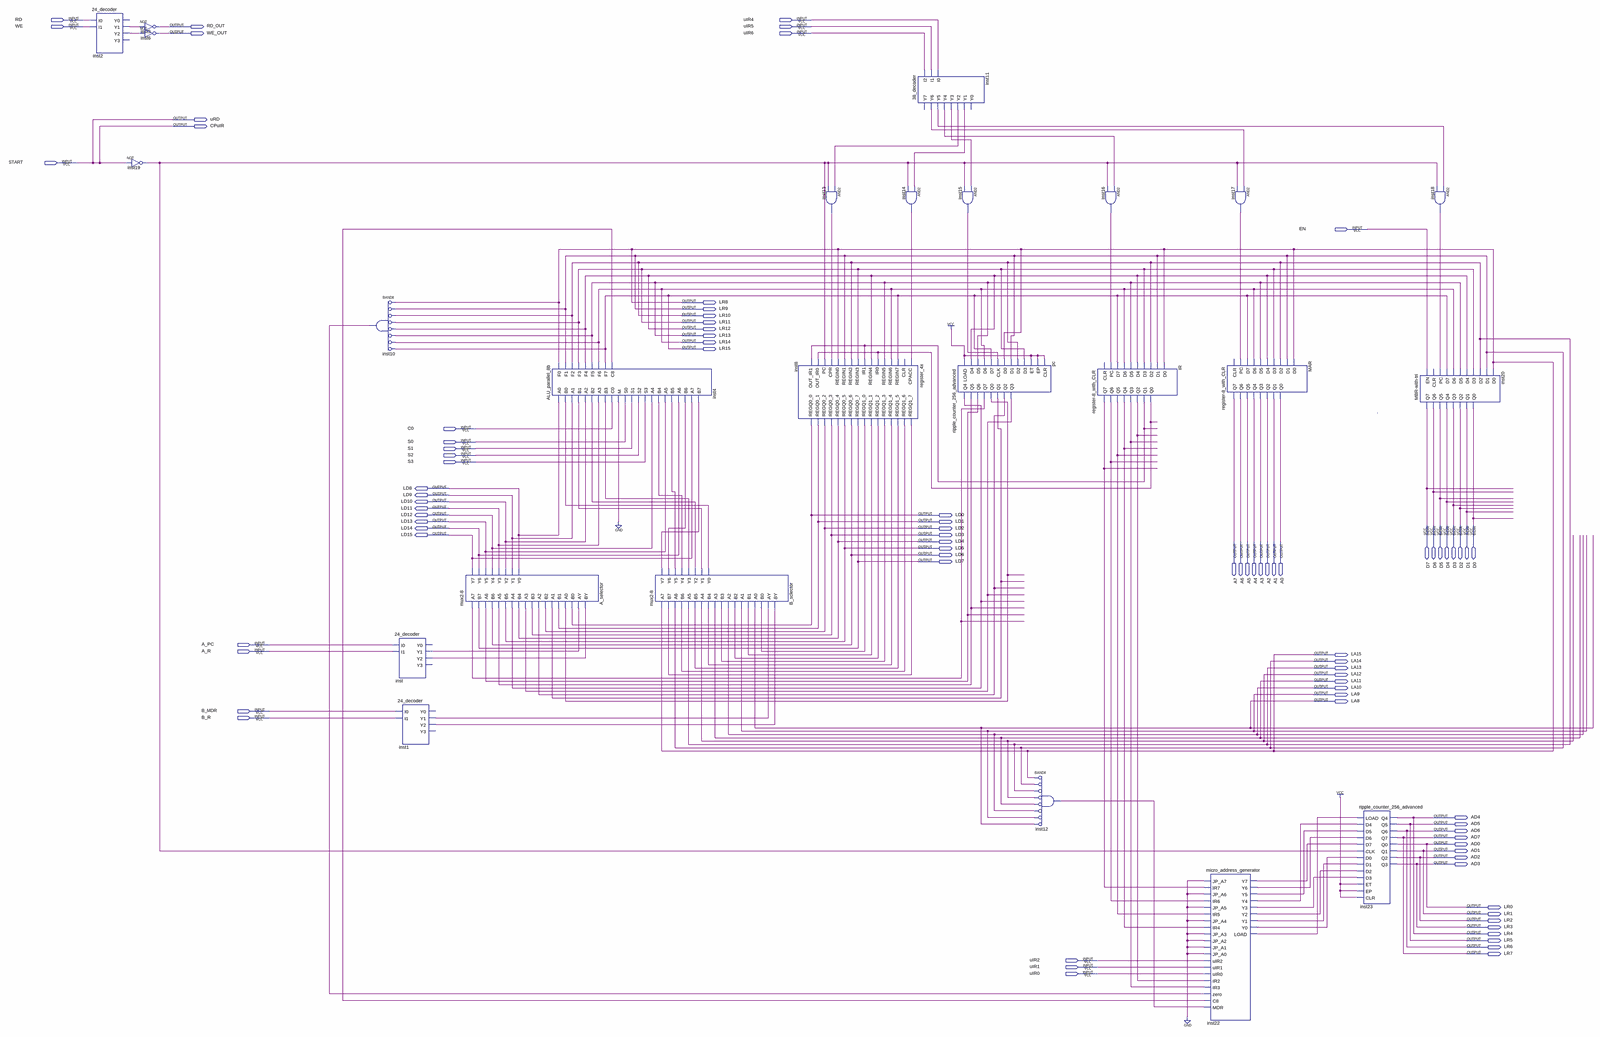
[diagram p0: schematic sheet, whole]
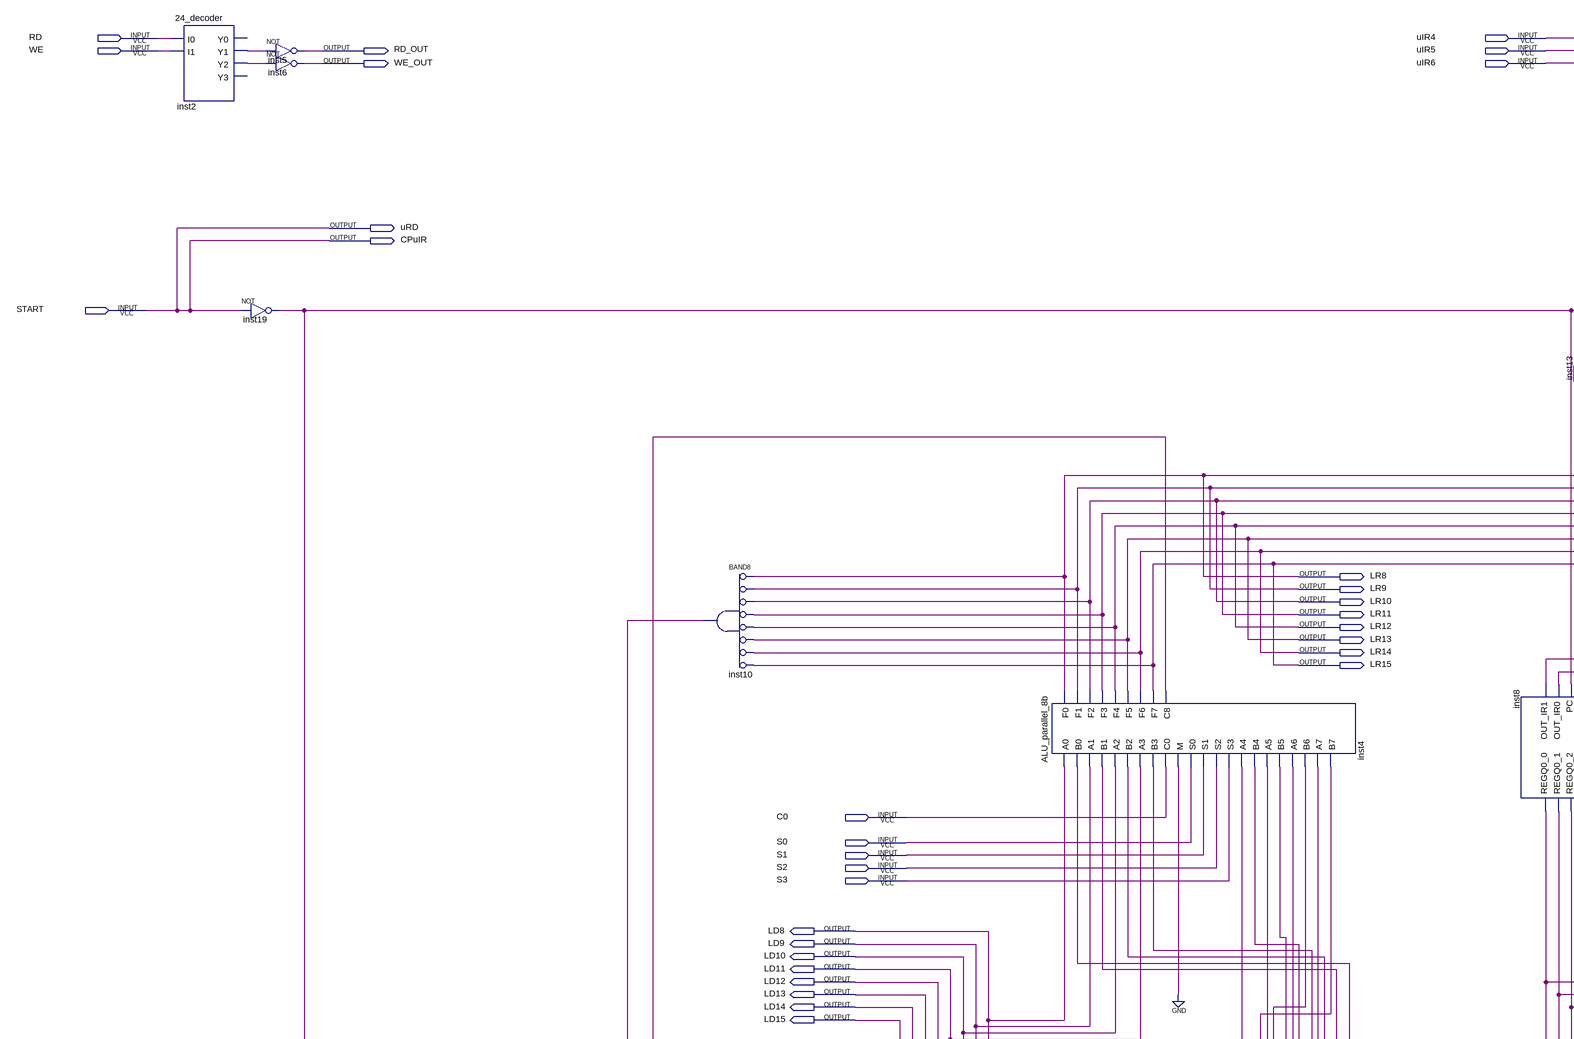
[diagram p1: schematic sheet, upper left part]
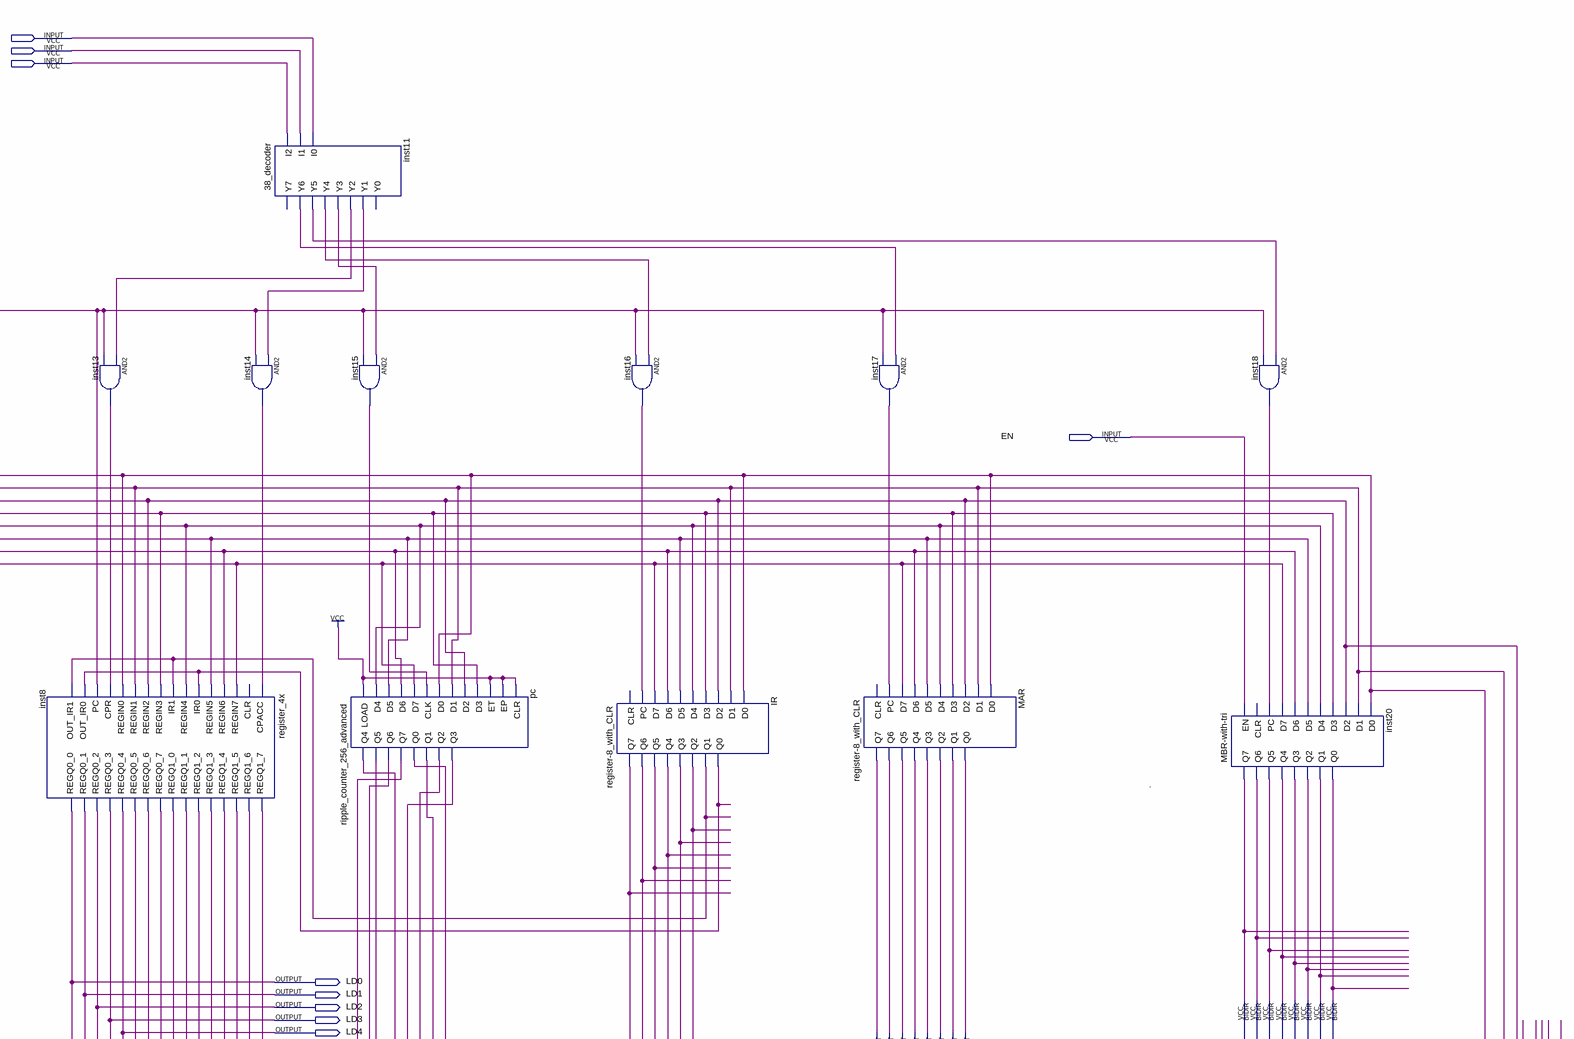
[diagram p2: schematic sheet, upper right part]
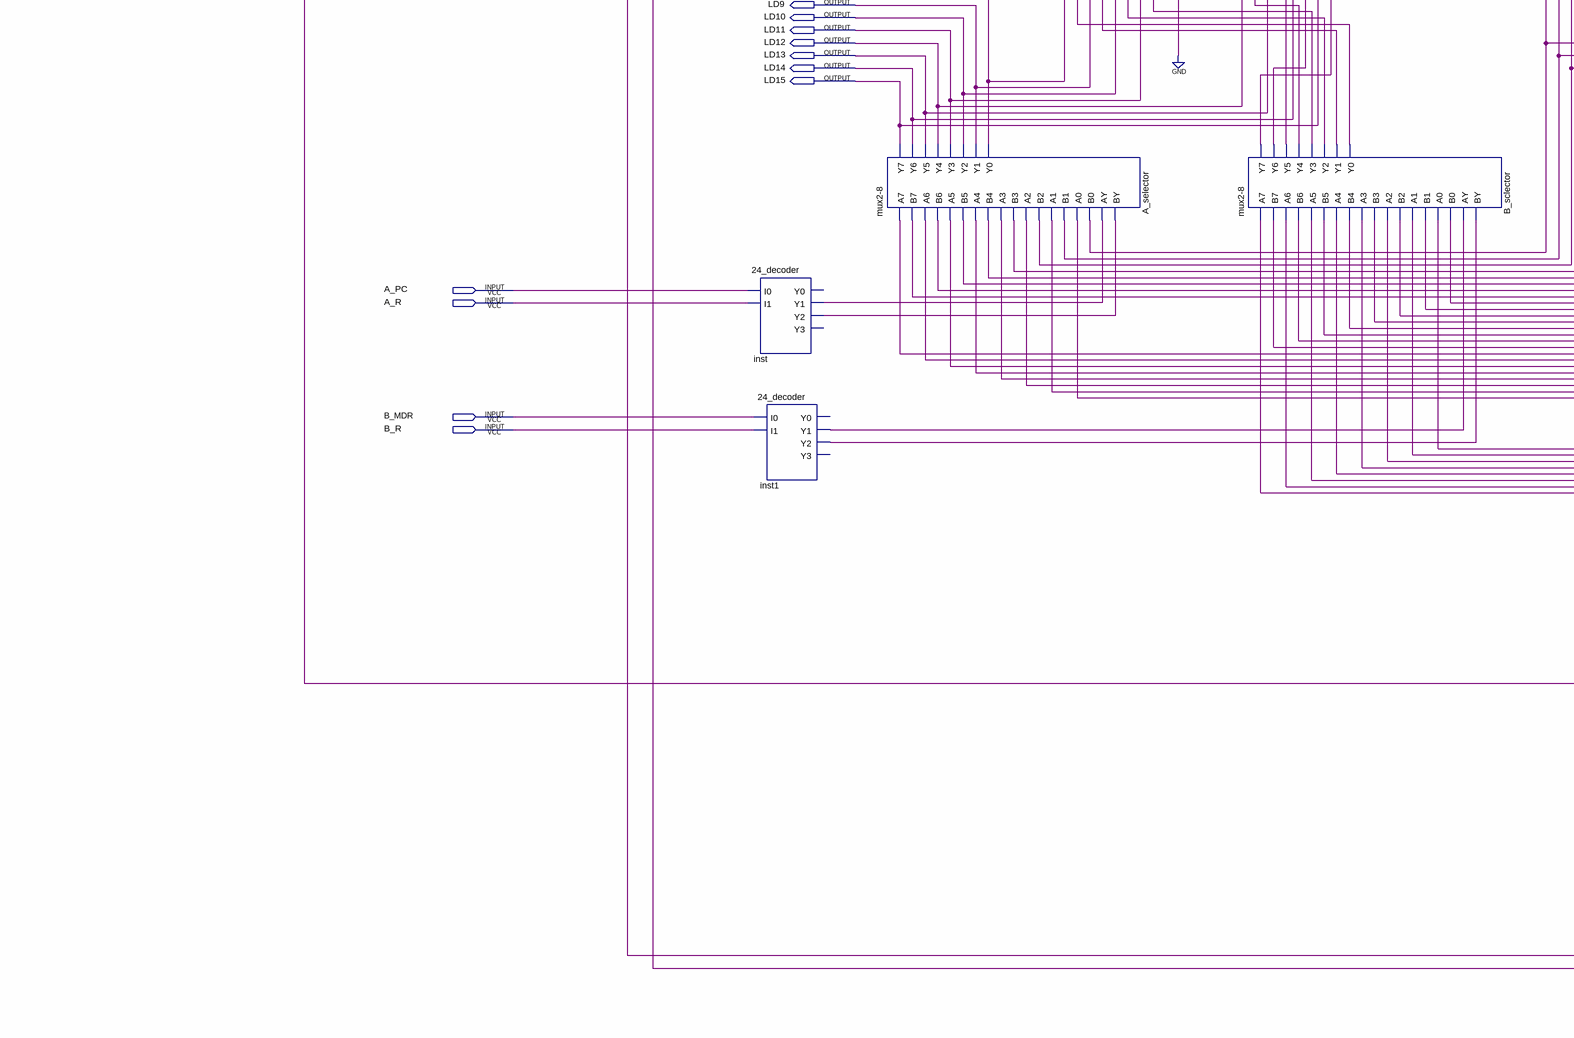
[diagram p3: schematic sheet, lower left part]
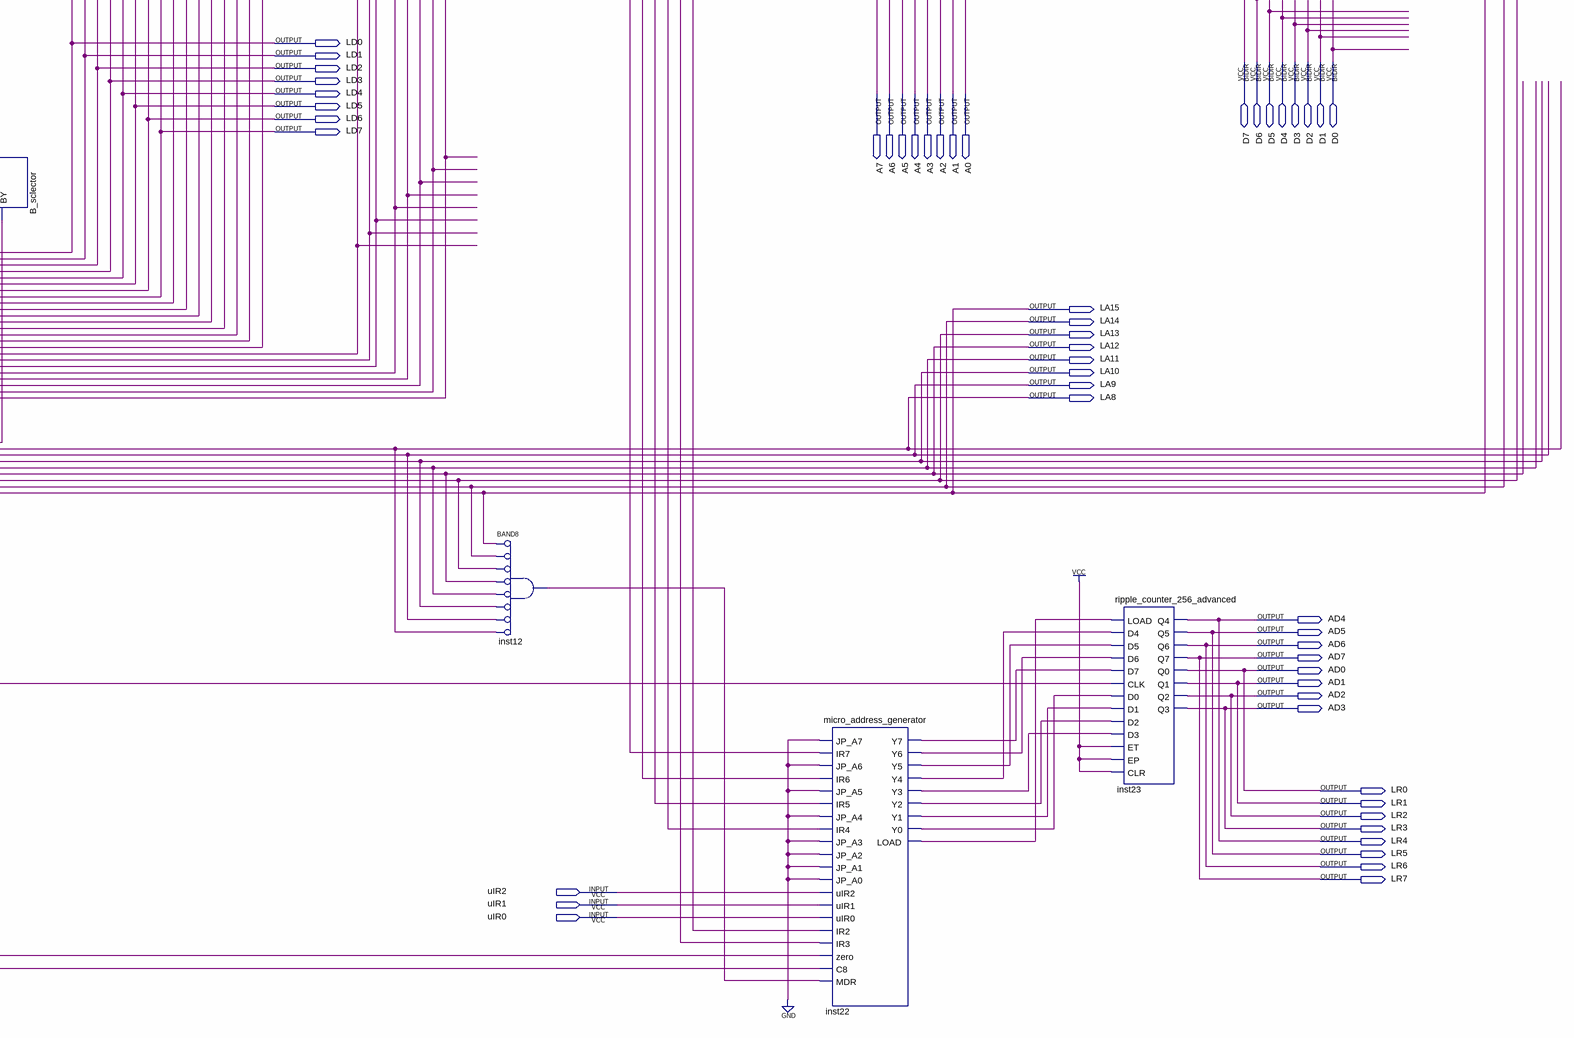
[diagram p4: schematic sheet, lower right part]
// Quartus schematic machine_v1.bdf as structural Verilog: 25 symbols, 87 pins
module machine_v1 (
  input  RD,
  input  uIR4,
  input  WE,
  input  uIR5,
  input  uIR6,
  input  START,
  input  EN,
  input  C0,
  input  S0,
  input  S1,
  input  S2,
  input  S3,
  input  A_PC,
  input  A_R,
  input  B_MDR,
  input  B_R,
  input  uIR2,
  input  uIR1,
  input  uIR0,
  inout  D7,
  inout  D6,
  inout  D5,
  inout  D4,
  inout  D3,
  inout  D2,
  inout  D1,
  inout  D0,
  output RD_OUT,
  output WE_OUT,
  output uRD,
  output CPuIR,
  output LR8,
  output LR9,
  output LR10,
  output LR11,
  output LR12,
  output LR13,
  output LR14,
  output LR15,
  output LD8,
  output LD9,
  output LD10,
  output LD11,
  output LD12,
  output LD0,
  output LD13,
  output LD1,
  output LD14,
  output LD2,
  output LD15,
  output LD3,
  output LD4,
  output A7,
  output A6,
  output A5,
  output A4,
  output A3,
  output A2,
  output A1,
  output A0,
  output LD5,
  output LD6,
  output LD7,
  output LA15,
  output LA14,
  output LA13,
  output LA12,
  output LA11,
  output LA10,
  output LA9,
  output LA8,
  output AD4,
  output AD5,
  output AD6,
  output AD7,
  output AD0,
  output AD1,
  output AD2,
  output AD3,
  output LR0,
  output LR1,
  output LR2,
  output LR3,
  output LR4,
  output LR5,
  output LR6,
  output LR7
);

  wire B_sclector_y0, B_sclector_y1, B_sclector_y2, B_sclector_y3, B_sclector_y4, B_sclector_y5,
       B_sclector_y6, B_sclector_y7, inst1_y1, inst1_y2, inst2_y1, inst2_y2, inst4_c8, inst8_regq1_0,
       inst8_regq1_1, inst8_regq1_2, inst8_regq1_3, inst8_regq1_4, inst8_regq1_5, inst8_regq1_6,
       inst8_regq1_7, inst10_out, inst11_y1, inst11_y2, inst11_y3, inst11_y4, inst11_y5, inst11_y6,
       inst12_out, inst13_out, inst14_out, inst15_out, inst16_out, inst17_out, inst18_out, inst19_out,
       inst22_load, inst22_y0, inst22_y1, inst22_y2, inst22_y3, inst22_y4, inst22_y5, inst22_y6, inst22_y7,
       inst_y1, inst_y2, IR_q0, IR_q1, IR_q2, IR_q3, IR_q4, IR_q5, IR_q6, IR_q7, pc_q0, pc_q1, pc_q2, pc_q3,
       pc_q4, pc_q5, pc_q6, pc_q7;

  \24_decoder  inst2 (.I0(RD), .I1(WE), .Y1(inst2_y1), .Y2(inst2_y2));  // open: Y0, Y3
  not inst19 (inst19_out, START);
  not inst5 (RD_OUT, inst2_y1);
  not inst6 (WE_OUT, inst2_y2);
  and inst10 (inst10_out, ~LA15, ~LA14, ~LA13, ~LR11, ~LR12, ~LR13, ~LR14, ~LR15);  // BAND8
  \24_decoder  inst (.I0(A_PC), .I1(A_R), .Y1(inst_y1), .Y2(inst_y2));  // open: Y0, Y3
  \24_decoder  inst1 (.I0(B_MDR), .I1(B_R), .Y1(inst1_y1), .Y2(inst1_y2));  // open: Y0, Y3
  \mux2-8  A_selector (
    .A7(pc_q7), .B7(LD7), .A6(pc_q6), .B6(LD6), .A5(pc_q5), .B5(LD5), .A4(pc_q4), .B4(LD4), .A3(pc_q3),
    .B3(LD3), .A2(pc_q2), .B2(LD2), .A1(pc_q1), .B1(LD1), .A0(pc_q0), .B0(LD0), .AY(inst_y1), .BY(inst_y2),
    .Y7(LD15), .Y6(LD14), .Y5(LD13), .Y4(LD12), .Y3(LD11), .Y2(LD10), .Y1(LD9), .Y0(LD8));
  ALU_parallel_8b inst4 (
    .A0(LD8), .B0(B_sclector_y0), .A1(LD9), .B1(B_sclector_y1), .A2(LD10), .B2(B_sclector_y2), .A3(LD11),
    .B3(B_sclector_y3), .C0(C0), .M(1'b0), .S0(S0), .S1(S1), .S2(S2), .S3(S3), .A4(LD12), .B4(B_sclector_y4),
    .A5(LD13), .B5(B_sclector_y5), .A6(LD14), .B6(B_sclector_y6), .A7(LD15), .B7(B_sclector_y7), .F0(LA15),
    .F1(LA14), .F2(LA13), .F3(LR11), .F4(LR12), .F5(LR13), .F6(LR14), .F7(LR15), .C8(inst4_c8));
  \mux2-8  B_sclector (
    .A7(LA15), .B7(inst8_regq1_7), .A6(LA14), .B6(inst8_regq1_6), .A5(LA13), .B5(inst8_regq1_5), .A4(LA12),
    .B4(inst8_regq1_4), .A3(LA11), .B3(inst8_regq1_3), .A2(LA10), .B2(inst8_regq1_2), .A1(LA9),
    .B1(inst8_regq1_1), .A0(LA8), .B0(inst8_regq1_0), .AY(inst1_y1), .BY(inst1_y2), .Y7(B_sclector_y7),
    .Y6(B_sclector_y6), .Y5(B_sclector_y5), .Y4(B_sclector_y4), .Y3(B_sclector_y3), .Y2(B_sclector_y2),
    .Y1(B_sclector_y1), .Y0(B_sclector_y0));
  register_4x inst8 (
    .CPACC(inst14_out), .REGIN7(LR15), .REGIN6(LR14), .REGIN5(LR13), .IR0(IR_q0), .REGIN4(LR12), .IR1(IR_q1),
    .REGIN3(LR11), .REGIN2(LA13), .REGIN1(LA14), .REGIN0(LA15), .CPR(inst13_out), .PC(inst19_out),
    .OUT_IR0(IR_q0), .OUT_IR1(IR_q1), .REGQ1_7(inst8_regq1_7), .REGQ1_6(inst8_regq1_6),
    .REGQ1_5(inst8_regq1_5), .REGQ1_4(inst8_regq1_4), .REGQ1_3(inst8_regq1_3), .REGQ1_2(inst8_regq1_2),
    .REGQ1_1(inst8_regq1_1), .REGQ1_0(inst8_regq1_0), .REGQ0_7(LD7), .REGQ0_6(LD6), .REGQ0_5(LD5),
    .REGQ0_4(LD4), .REGQ0_3(LD3), .REGQ0_2(LD2), .REGQ0_1(LD1), .REGQ0_0(LD0));  // open: CLR
  and inst13 (inst13_out, inst11_y2, inst19_out);
  \38_decoder  inst11 (
    .I2(uIR6), .I1(uIR5), .I0(uIR4), .Y6(inst11_y6), .Y5(inst11_y5), .Y4(inst11_y4), .Y3(inst11_y3),
    .Y2(inst11_y2), .Y1(inst11_y1));  // open: Y7, Y0
  and inst14 (inst14_out, inst11_y1, inst19_out);
  ripple_counter_256_advanced pc (
    .LOAD(1'b1), .D4(LR12), .D5(LR13), .D6(LR14), .D7(LR15), .CLK(inst15_out), .D0(LA15), .D1(LA14),
    .D2(LA13), .D3(LR11), .ET(1'b1), .EP(1'b1), .CLR(1'b1), .Q4(pc_q4), .Q5(pc_q5), .Q6(pc_q6), .Q7(pc_q7),
    .Q0(pc_q0), .Q1(pc_q1), .Q2(pc_q2), .Q3(pc_q3));
  and inst15 (inst15_out, inst11_y3, inst19_out);
  and inst12 (inst12_out, ~LA15, ~LA14, ~LA13, ~LA12, ~LA11, ~LA10, ~LA9, ~LA8);  // BAND8
  and inst16 (inst16_out, inst11_y4, inst19_out);
  \register-8_with_CLR  IR (
    .PC(inst16_out), .D7(LR15), .D6(LR14), .D5(LR13), .D4(LR12), .D3(LR11), .D2(LA13), .D1(LA14), .D0(LA15),
    .Q7(IR_q7), .Q6(IR_q6), .Q5(IR_q5), .Q4(IR_q4), .Q3(IR_q3), .Q2(IR_q2), .Q1(IR_q1), .Q0(IR_q0));  // open: CLR
  micro_address_generator inst22 (
    .JP_A7(1'b0), .IR7(IR_q7), .JP_A6(1'b0), .IR6(IR_q6), .JP_A5(1'b0), .IR5(IR_q5), .JP_A4(1'b0),
    .IR4(IR_q4), .JP_A3(1'b0), .JP_A2(1'b0), .JP_A1(1'b0), .JP_A0(1'b0), .uIR2(uIR2), .uIR1(uIR1),
    .uIR0(uIR0), .IR2(IR_q2), .IR3(IR_q3), .zero(inst10_out), .C8(inst4_c8), .MDR(inst12_out),
    .Y7(inst22_y7), .Y6(inst22_y6), .Y5(inst22_y5), .Y4(inst22_y4), .Y3(inst22_y3), .Y2(inst22_y2),
    .Y1(inst22_y1), .Y0(inst22_y0), .LOAD(inst22_load));
  and inst17 (inst17_out, inst11_y6, inst19_out);
  \register-8_with_CLR  MAR (
    .PC(inst17_out), .D7(LR15), .D6(LR14), .D5(LR13), .D4(LR12), .D3(LR11), .D2(LA13), .D1(LA14), .D0(LA15),
    .Q7(A7), .Q6(A6), .Q5(A5), .Q4(A4), .Q3(A3), .Q2(A2), .Q1(A1), .Q0(A0));  // open: CLR
  ripple_counter_256_advanced inst23 (
    .LOAD(inst22_load), .D4(inst22_y4), .D5(inst22_y5), .D6(inst22_y6), .D7(inst22_y7), .CLK(inst19_out),
    .D0(inst22_y0), .D1(inst22_y1), .D2(inst22_y2), .D3(inst22_y3), .ET(1'b1), .EP(1'b1), .CLR(1'b1),
    .Q4(AD4), .Q5(AD5), .Q6(AD6), .Q7(AD7), .Q0(AD0), .Q1(AD1), .Q2(AD2), .Q3(AD3));
  and inst18 (inst18_out, inst11_y5, inst19_out);
  \MBR-with-tri  inst20 (
    .EN(EN), .PC(inst18_out), .D7(LR15), .D6(LR14), .D5(LR13), .D4(LR12), .D3(LR11), .D2(LA13), .D1(LA14),
    .D0(LA15), .Q7(D7), .Q6(D6), .Q5(D5), .Q4(D4), .Q3(D3), .Q2(D2), .Q1(D1), .Q0(D0));  // open: CLR

  assign CPuIR = START;
  assign LR0 = AD0;
  assign LR1 = AD1;
  assign LR2 = AD2;
  assign LR3 = AD3;
  assign LR4 = AD4;
  assign LR5 = AD5;
  assign LR6 = AD6;
  assign LR7 = AD7;
  assign LR8 = LA15;
  assign LR9 = LA14;
  assign LR10 = LA13;
  assign uRD = START;

  // Notes on the sheet:
  //   .
endmodule
